# Altium schematic sheet led.SchDoc
size A3
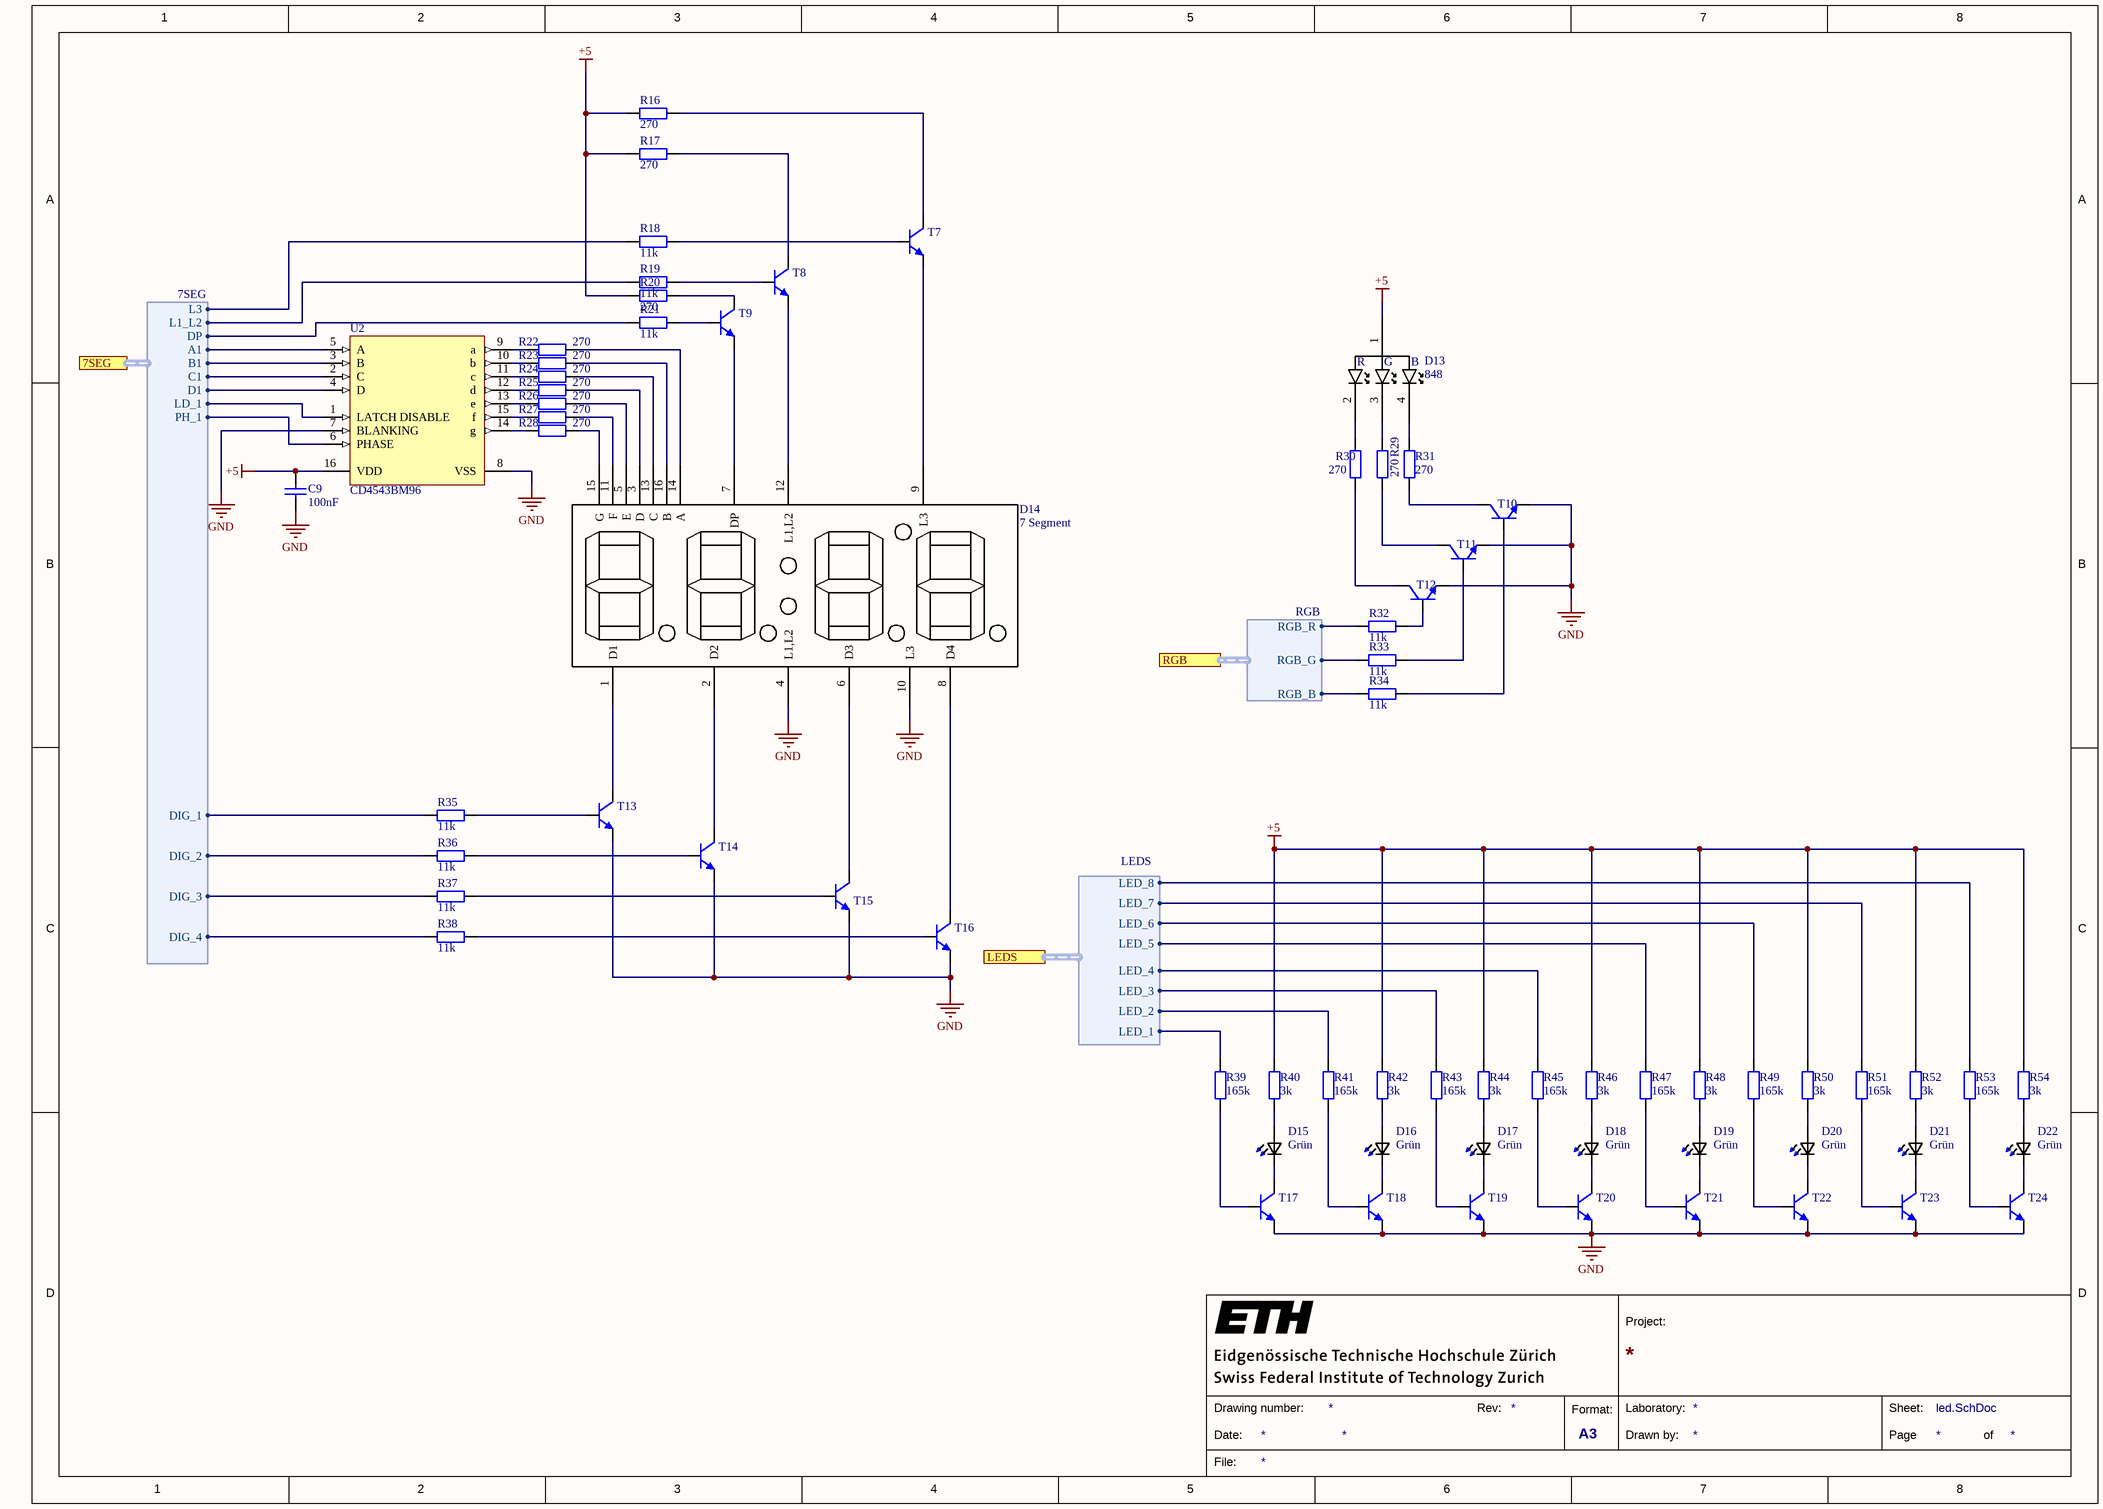
[diagram p0: led.SchDoc]

## Parts
C9  100nF  [CAP_0603i_1608m -N]
D13  848  [Adafruit-848]
D14  7 Segment  [TDCG1060M]
D15  Grün  [*0603]
D16  Grün  [*0603]
D17  Grün  [*0603]
D18  Grün  [*0603]
D19  Grün  [*0603]
D20  Grün  [*0603]
D21  Grün  [*0603]
D22  Grün  [*0603]
R16  270  [RES_0603i_1608m -N]
R17  270  [RES_0603i_1608m -N]
R18  11k  [RES_0603i_1608m -N]
R19  11k  [RES_0603i_1608m -N]
R20  270  [RES_0603i_1608m -N]
R21  11k  [RES_0603i_1608m -N]
R22  270  [RES_0603i_1608m -N]
R23  270  [RES_0603i_1608m -N]
R24  270  [RES_0603i_1608m -N]
R25  270  [RES_0603i_1608m -N]
R26  270  [RES_0603i_1608m -N]
R27  270  [RES_0603i_1608m -N]
R28  270  [RES_0603i_1608m -N]
R29  270  [RES_0603i_1608m -N]
R30  270  [RES_0603i_1608m -N]
R31  270  [RES_0603i_1608m -N]
R32  11k  [RES_0603i_1608m -N]
R33  11k  [RES_0603i_1608m -N]
R34  11k  [RES_0603i_1608m -N]
R35  11k  [RES_0603i_1608m -N]
R36  11k  [RES_0603i_1608m -N]
R37  11k  [RES_0603i_1608m -N]
R38  11k  [RES_0603i_1608m -N]
R39  165k  [RES_0603i_1608m -N]
R40  3k  [RES_0603i_1608m -N]
R41  165k  [RES_0603i_1608m -N]
R42  3k  [RES_0603i_1608m -N]
R43  165k  [RES_0603i_1608m -N]
R44  3k  [RES_0603i_1608m -N]
R45  165k  [RES_0603i_1608m -N]
R46  3k  [RES_0603i_1608m -N]
R47  165k  [RES_0603i_1608m -N]
R48  3k  [RES_0603i_1608m -N]
R49  165k  [RES_0603i_1608m -N]
R50  3k  [RES_0603i_1608m -N]
R51  165k  [RES_0603i_1608m -N]
R52  3k  [RES_0603i_1608m -N]
R53  165k  [RES_0603i_1608m -N]
R54  3k  [RES_0603i_1608m -N]
T7  Part Number: MMBT3904-7-F  [SOT-23-M]  (value not drawn)
T8  Part Number: MMBT3904-7-F  [SOT-23-M]  (value not drawn)
T9  Part Number: MMBT3904-7-F  [SOT-23-M]  (value not drawn)
T10  Part Number: MMBT3904-7-F  [SOT-23-M]  (value not drawn)
T11  Part Number: MMBT3904-7-F  [SOT-23-M]  (value not drawn)
T12  Part Number: MMBT3904-7-F  [SOT-23-M]  (value not drawn)
T13  Part Number: MMBT3904-7-F  [SOT-23-M]  (value not drawn)
T14  Part Number: MMBT3904-7-F  [SOT-23-M]  (value not drawn)
T15  Part Number: MMBT3904-7-F  [SOT-23-M]  (value not drawn)
T16  Part Number: MMBT3904-7-F  [SOT-23-M]  (value not drawn)
T17  Part Number: MMBT3904-7-F  [SOT-23-M]  (value not drawn)
T18  Part Number: MMBT3904-7-F  [SOT-23-M]  (value not drawn)
T19  Part Number: MMBT3904-7-F  [SOT-23-M]  (value not drawn)
T20  Part Number: MMBT3904-7-F  [SOT-23-M]  (value not drawn)
T21  Part Number: MMBT3904-7-F  [SOT-23-M]  (value not drawn)
T22  Part Number: MMBT3904-7-F  [SOT-23-M]  (value not drawn)
T23  Part Number: MMBT3904-7-F  [SOT-23-M]  (value not drawn)
T24  Part Number: MMBT3904-7-F  [SOT-23-M]  (value not drawn)
U2  CD4543BM96  [D0016A_L]

## Ports
7SEG (harness 7SEG), LEDS (harness LEDS), RGB (harness RGB)

## Harnesses
LEDS: LED_5, LED_4, LED_3, LED_2, LED_1, LED_6, LED_7, LED_8
7SEG: PH_1, LD_1, D1, C1, B1, A1, DP, L1_L2, L3, DIG_1, DIG_2, DIG_3, DIG_4
RGB: RGB_R, RGB_G, RGB_B

## Nets
+5: C9.2 D13.1 R16.2 R17.2 R20.1 R40.2 R42.2 R44.2 R46.2 R48.2 R50.2 R52.2 R54.2 U2.16(VDD)
GND: C9.1 D14.4(L1,L2) D14.10(L3) T10.2(E) T11.2(E) T12.2(E) T13.2(E) T14.2(E) T15.2(E) T16.2(E) T17.2(E) T18.2(E) T19.2(E) T20.2(E) T21.2(E) T22.2(E) T23.2(E) T24.2(E) U2.7(BLANKING) U2.8(VSS)
NetD13_2: D13.2 R30.2
NetD13_3: D13.3 R29.2
NetD13_4: D13.4 R31.2
NetD14_1: D14.1(D1) T13.3(C)
NetD14_2: D14.2(D2) T14.3(C)
NetD14_3: D14.3(D) R25.1
NetD14_5: D14.5(E) R26.1
NetD14_6: D14.6(D3) T15.3(C)
NetD14_7: D14.7(DP) T9.2(E)
NetD14_8: D14.8(D4) T16.3(C)
NetD14_9: D14.9(L3) T7.2(E)
NetD14_11: D14.11(F) R27.1
NetD14_12: D14.12(L1,L2) T8.2(E)
NetD14_13: D14.13(C) R24.1
NetD14_14: D14.14(A) R22.1
NetD14_15: D14.15(G) R28.1
NetD14_16: D14.16(B) R23.1
NetD15_1: D15.1(K2) T17.3(C)
NetD15_2: D15.2(A2) R40.1
NetD16_1: D16.1(K2) T18.3(C)
NetD16_2: D16.2(A2) R42.1
NetD17_1: D17.1(K2) T19.3(C)
NetD17_2: D17.2(A2) R44.1
NetD18_1: D18.1(K2) T20.3(C)
NetD18_2: D18.2(A2) R46.1
NetD19_1: D19.1(K2) T21.3(C)
NetD19_2: D19.2(A2) R48.1
NetD20_1: D20.1(K2) T22.3(C)
NetD20_2: D20.2(A2) R50.1
NetD21_1: D21.1(K2) T23.3(C)
NetD21_2: D21.2(A2) R52.1
NetD22_1: D22.1(K2) T24.3(C)
NetD22_2: D22.2(A2) R54.1
NetR16_1: R16.1 T7.3(C)
NetR17_1: R17.1 T8.3(C)
NetR18_1: R18.1 T7.1(B)
NetR18_2: R18.2 ; port 7SEG.L3
NetR19_1: R19.1 T8.1(B)
NetR19_2: R19.2 ; port 7SEG.L1_L2
NetR20_2: R20.2 T9.3(C)
NetR21_1: R21.1 ; port 7SEG.DP
NetR21_2: R21.2 T9.1(B)
NetR22_2: R22.2 U2.9(a)
NetR23_2: R23.2 U2.10(b)
NetR24_2: R24.2 U2.11(c)
NetR25_2: R25.2 U2.12(d)
NetR26_2: R26.2 U2.13(e)
NetR27_2: R27.2 U2.15(f)
NetR28_2: R28.2 U2.14(g)
NetR29_1: R29.1 T11.3(C)
NetR30_1: R30.1 T12.3(C)
NetR31_1: R31.1 T10.3(C)
NetR32_1: R32.1 ; port RGB.RGB_R
NetR32_2: R32.2 T12.1(B)
NetR33_1: R33.1 ; port RGB.RGB_G
NetR33_2: R33.2 T11.1(B)
NetR34_1: R34.1 ; port RGB.RGB_B
NetR34_2: R34.2 T10.1(B)
NetR35_1: R35.1 ; port 7SEG.DIG_1
NetR35_2: R35.2 T13.1(B)
NetR36_1: R36.1 ; port 7SEG.DIG_2
NetR36_2: R36.2 T14.1(B)
NetR37_1: R37.1 ; port 7SEG.DIG_3
NetR37_2: R37.2 T15.1(B)
NetR38_1: R38.1 ; port 7SEG.DIG_4
NetR38_2: R38.2 T16.1(B)
NetR39_1: R39.1 T17.1(B)
NetR39_2: R39.2 ; port LEDS.LED_1
NetR41_1: R41.1 T18.1(B)
NetR41_2: R41.2 ; port LEDS.LED_2
NetR43_1: R43.1 T19.1(B)
NetR43_2: R43.2 ; port LEDS.LED_3
NetR45_1: R45.1 T20.1(B)
NetR45_2: R45.2 ; port LEDS.LED_4
NetR47_1: R47.1 T21.1(B)
NetR47_2: R47.2 ; port LEDS.LED_5
NetR49_1: R49.1 T22.1(B)
NetR49_2: R49.2 ; port LEDS.LED_6
NetR51_1: R51.1 T23.1(B)
NetR51_2: R51.2 ; port LEDS.LED_7
NetR53_1: R53.1 T24.1(B)
NetR53_2: R53.2 ; port LEDS.LED_8
NetU2_1: U2.1(LATCH_DISABLE) ; port 7SEG.LD_1
NetU2_2: U2.2(C) ; port 7SEG.C1
NetU2_3: U2.3(B) ; port 7SEG.B1
NetU2_4: U2.4(D) ; port 7SEG.D1
NetU2_5: U2.5(A) ; port 7SEG.A1
NetU2_6: U2.6(PHASE) ; port 7SEG.PH_1

## Notes on the sheet
- 1
- 2
- 3
- 4
- 5
- 6
- 7
- 8
- A
- B
- C
- D
- Project:
- Date:
- Drawing number:
- Rev:
- Format:
- A3
- Drawn by:
- Laboratory:
- Page
- Sheet:
- of
- File:
- (in symbol Adafruit-848) R; G; B

## Library data of the parts
C9 = Cap: capacitor
D13 = Adafruit-848
D14 = TDCG1060M
D15-D22 = LTST-C191KGKT: / LED; SMD; 0603; grün; 35mcd; 1.6x0.8x0.55mm; 130Â°; 2Ã·2.V; 20mA /; MF: Lite-On Inc.; Digi-Key_Purchase_URL: https://www.digikey.ch/product-detail/de/lite-on-inc/LTST-C191KGKT/160-1446-1-ND/386834; SnapEDA_Link: https://www.snapeda.com/parts/LTST-C191KFKT/Lite-On%20Inc./view-part/?ref=snap; MP: LTST-C191KGKT; Digi-Key_Part_Number: 160-1446-1-ND; Package: 0603 Lite-On; Value: *
R16-R54 = Res: Resistor
T7-T24 = MMBT3904-7-F: No Description Available; Vendor: Diodes Inc; Built_By: EMA_UL_Team; Type: DEV; Manufacturer_Part_Number: MMBT3904-7-F; Copyright: Copyright (C) 2018 Accelerated Designs. All rights reserved; RefDes: RefDes; Value: Value
U2 = CMP-0388-00008-2: CMOS BCD-to-7-Segment Latch / Decoder / Driver for Liquid-Crystal Displays, 3 V, -55 to 125 degC, 16-pin SOIC (D16), Green (RoHS & no Sb/Br); Manufacturer: Texas Instruments; Vin(Min)(V): 3; SubFamily: Discrete Segment LED Driver; Rating: Catalog; ComponentLink2URL: http://www.ti.com/general/docs/lit/getliterature.tsp?genericPartNumber=CD4543B&fileType=pdf; ComponentLink1URL: http://www.ti.com/; PartNumber: CD4543BM96; ComponentLink3URL: http://www.ti.com/litv/pdf/mpds178g; Mounting Technology: Surface Mount; DatasheetVersion: SCHS086D; Code_JEDEC: MS-012; PackageDescription: 16-Pin Plastic Small Outline, Body 9.90 x 3.90 mm, Pitch 1.27 mm; ComponentLink1Description: Manufacturer URL; ComponentLink3Description: Package Specification; PackageVersion: 4040047-6/M; Eco-Plan: Green (RoHS & no Sb/Br); ComponentLink2Description: Datasheet; PackageReference: D0016A